# Altium schematic sheet LED_String_NE2R757GT-P6.SchDoc: STB Light Board - blue String
size A4; Author: flmoll; DrawnBy: flmoll; Organization: PBL; Revision: A; SheetNumber: 20; SheetTotal: 20
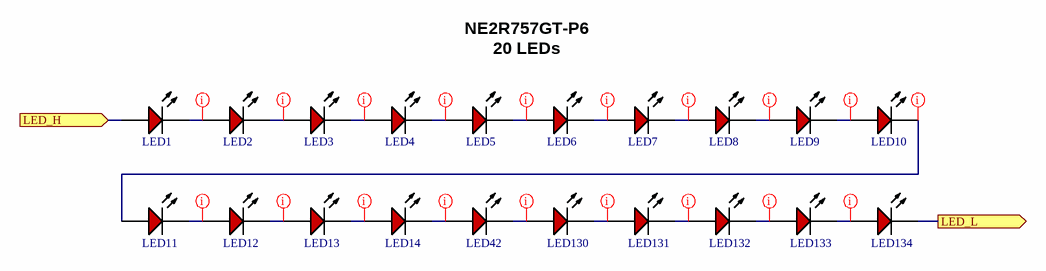
[diagram p0: LED_String_NE2R757GT-P6.SchDoc]

## Parts
LED1  NE2R757GT-P6  [NE2R757GT-P6]  (value not drawn)
LED2  NE2R757GT-P6  [NE2R757GT-P6]  (value not drawn)
LED3  NE2R757GT-P6  [NE2R757GT-P6]  (value not drawn)
LED4  NE2R757GT-P6  [NE2R757GT-P6]  (value not drawn)
LED5  NE2R757GT-P6  [NE2R757GT-P6]  (value not drawn)
LED6  NE2R757GT-P6  [NE2R757GT-P6]  (value not drawn)
LED7  NE2R757GT-P6  [NE2R757GT-P6]  (value not drawn)
LED8  NE2R757GT-P6  [NE2R757GT-P6]  (value not drawn)
LED9  NE2R757GT-P6  [NE2R757GT-P6]  (value not drawn)
LED10  NE2R757GT-P6  [NE2R757GT-P6]  (value not drawn)
LED11  NE2R757GT-P6  [NE2R757GT-P6]  (value not drawn)
LED12  NE2R757GT-P6  [NE2R757GT-P6]  (value not drawn)
LED13  NE2R757GT-P6  [NE2R757GT-P6]  (value not drawn)
LED14  NE2R757GT-P6  [NE2R757GT-P6]  (value not drawn)
LED42  NE2R757GT-P6  [NE2R757GT-P6]  (value not drawn)
LED130  NE2R757GT-P6  [NE2R757GT-P6]  (value not drawn)
LED131  NE2R757GT-P6  [NE2R757GT-P6]  (value not drawn)
LED132  NE2R757GT-P6  [NE2R757GT-P6]  (value not drawn)
LED133  NE2R757GT-P6  [NE2R757GT-P6]  (value not drawn)
LED134  NE2R757GT-P6  [NE2R757GT-P6]  (value not drawn)

## Ports
LED_H (in, see LED_Driver_NE2R757GT-P6[3B]), LED_L (out, see LED_Driver_NE2R757GT-P6[3B])

## Nets
LED_H: LED1.2(A) ; port LED_H
LED_L: LED134.1(K) ; port LED_L
NetLED1_1: LED1.1(K) LED2.2(A)
NetLED2_1: LED2.1(K) LED3.2(A)
NetLED3_1: LED3.1(K) LED4.2(A)
NetLED4_1: LED4.1(K) LED5.2(A)
NetLED5_1: LED5.1(K) LED6.2(A)
NetLED6_1: LED6.1(K) LED7.2(A)
NetLED7_1: LED7.1(K) LED8.2(A)
NetLED8_1: LED8.1(K) LED9.2(A)
NetLED9_1: LED9.1(K) LED10.2(A)
NetLED10_1: LED10.1(K) LED11.2(A)
NetLED11_1: LED11.1(K) LED12.2(A)
NetLED12_1: LED12.1(K) LED13.2(A)
NetLED13_1: LED13.1(K) LED14.2(A)
NetLED14_1: LED14.1(K) LED42.2(A)
NetLED42_1: LED42.1(K) LED130.2(A)
NetLED130_1: LED130.1(K) LED131.2(A)
NetLED131_1: LED131.1(K) LED132.2(A)
NetLED132_1: LED132.1(K) LED133.2(A)
NetLED133_1: LED133.1(K) LED134.2(A)

## Layout directives
net class LED: NetLED1_1, NetLED2_1, NetLED3_1, NetLED4_1, NetLED5_1, NetLED6_1, NetLED7_1, NetLED8_1, NetLED9_1, NetLED10_1, NetLED11_1, NetLED12_1, NetLED13_1, NetLED14_1, NetLED42_1, NetLED130_1, NetLED131_1, NetLED132_1, NetLED133_1

## Notes on the sheet
- NE2R757GT-P6
- 20 LEDs
- 1
- 2
- 3
- 4
- A
- B
- C
- Project:
- D
- Date:
- Drawing number:
- Rev:
- Format:
- A4 Q
- Drawn by:
- Laboratory:
- Page
- Sheet:
- of
- File:

## Library data of the parts
LED1-LED14 LED42 LED130-LED134 = CMP-02062-1: SMD LED Red 2,13 V, 16 lm 3030 (1212); Manufacturer: Nichia; Optoelectronic Device Type: SINGLE COLOR LED; Vf: 2.13 V; Intensity: 16 lm; REACH SVHC: No SVHC; RoHS Compliant: Yes; Color: Red; Manufacturer Part Number: NE2R757GT-P6